# EAGLE design omnetics-adapter-64 (EAGLE 8.3.2)
DESIGNER: JON NEWMAN; DESIGN_NAME: OMNETICS-ADAPTER-64; LICENSE: CERN OHL v1.2; REVISION: 1.1
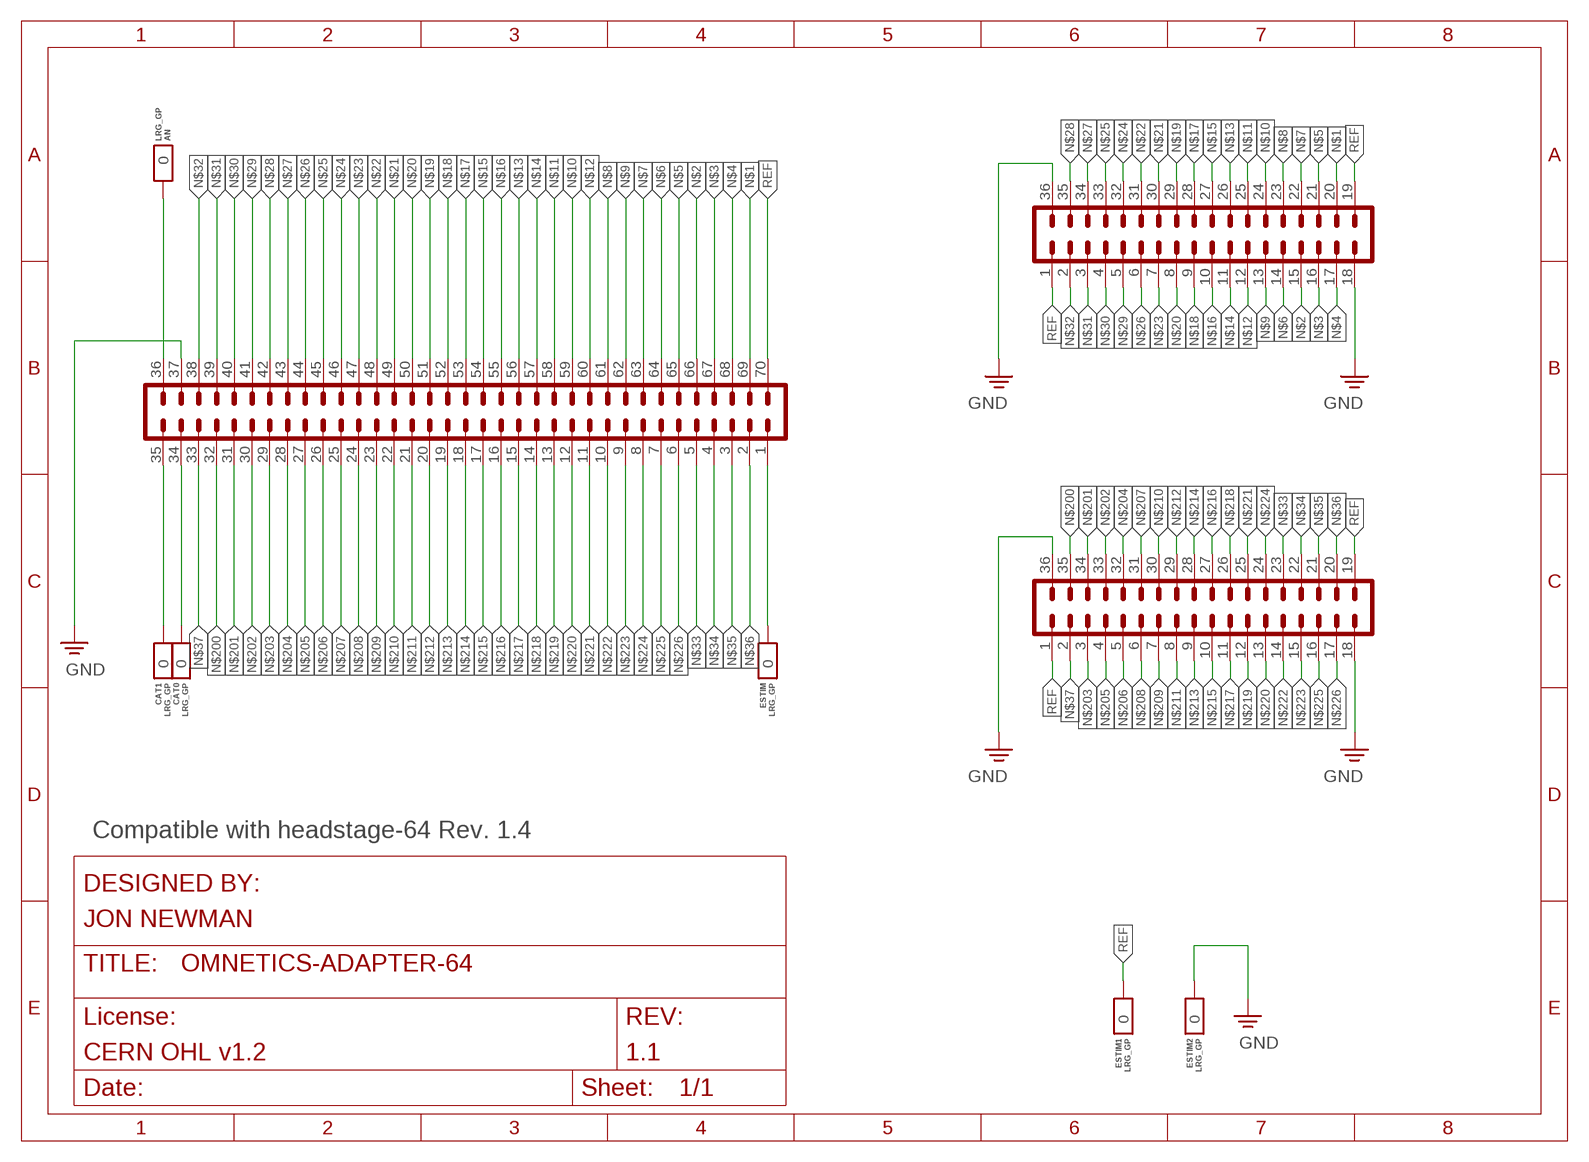
[diagram p0: schematic, sheet 1]

## Parts
AN  LRG_GP  GOLDPIN_0.5ID_0.7OD  [GOLDPIN_0.5ID_0.7OD]
CAT0  LRG_GP  GOLDPIN_0.5ID_0.7OD  [GOLDPIN_0.5ID_0.7OD]
CAT1  LRG_GP  GOLDPIN_0.5ID_0.7OD  [GOLDPIN_0.5ID_0.7OD]
ESTIM  LRG_GP  GOLDPIN_0.5ID_0.7OD  [GOLDPIN_0.5ID_0.7OD]
ESTIM1  LRG_GP  GOLDPIN_0.5ID_0.7OD  [GOLDPIN_0.5ID_0.7OD]
ESTIM2  LRG_GP  GOLDPIN_0.5ID_0.7OD  [GOLDPIN_0.5ID_0.7OD]
J1  DF40-REC  PINHD-2X35_DF40REF-LRG  [DDF40-70REC-LRG]
J2  PINHD-2X18_NPD  [NPD-36-VV-GS]
J3  PINHD-2X18_NPD  [NPD-36-VV-GS]

## Nets
AN: AN.P$1 J1.36
CAT0: CAT0.P$1 J1.34
CAT1: CAT1.P$1 J1.35
ESTIM: ESTIM.P$1 J1.1
GND: ESTIM2.P$1 J1.37 J2.18 J2.36 J3.18 J3.36
N$1: J1.69 J2.20
N$2: J1.66 J2.15
N$3: J1.67 J2.16
N$4: J1.68 J2.17
N$5: J1.65 J2.21
N$6: J1.64 J2.14
N$7: J1.63 J2.22
N$8: J1.61 J2.23
N$9: J1.62 J2.13
N$10: J1.59 J2.24
N$11: J1.58 J2.25
N$12: J1.60 J2.12
N$13: J1.56 J2.26
N$14: J1.57 J2.11
N$15: J1.54 J2.27
N$16: J1.55 J2.10
N$17: J1.53 J2.28
N$18: J1.52 J2.9
N$19: J1.51 J2.29
N$20: J1.50 J2.8
N$21: J1.49 J2.30
N$22: J1.48 J2.31
N$23: J1.47 J2.7
N$24: J1.46 J2.32
N$25: J1.45 J2.33
N$26: J1.44 J2.6
N$27: J1.43 J2.34
N$28: J1.42 J2.35
N$29: J1.41 J2.5
N$30: J1.40 J2.4
N$31: J1.39 J2.3
N$32: J1.38 J2.2
N$33: J1.5 J3.23
N$34: J1.4 J3.22
N$35: J1.3 J3.21
N$36: J1.2 J3.20
N$37: J1.33 J3.2
N$200: J1.32 J3.35
N$201: J1.31 J3.34
N$202: J1.30 J3.33
N$203: J1.29 J3.3
N$204: J1.28 J3.32
N$205: J1.27 J3.4
N$206: J1.26 J3.5
N$207: J1.25 J3.31
N$208: J1.24 J3.6
N$209: J1.23 J3.7
N$210: J1.22 J3.30
N$211: J1.21 J3.8
N$212: J1.20 J3.29
N$213: J1.19 J3.9
N$214: J1.18 J3.28
N$215: J1.17 J3.10
N$216: J1.16 J3.27
N$217: J1.15 J3.11
N$218: J1.14 J3.26
N$219: J1.13 J3.12
N$220: J1.12 J3.13
N$221: J1.11 J3.25
N$222: J1.10 J3.14
N$223: J1.9 J3.15
N$224: J1.8 J3.24
N$225: J1.7 J3.16
N$226: J1.6 J3.17
REF: ESTIM1.P$1 J1.70 J2.1 J2.19 J3.1 J3.19

## Notes on the sheet
- Compatible with headstage-64 Rev. 1.4

## Library data of the parts
AN CAT0 CAT1 ESTIM ESTIM1 ESTIM2 = jonnew:GOLDPIN
J1 = jonnew:PINHD-2X35
J2 J3 = jonnew:PINHD-2X18: Omnetics 36-pin connector, vertical surface-mount

## Board
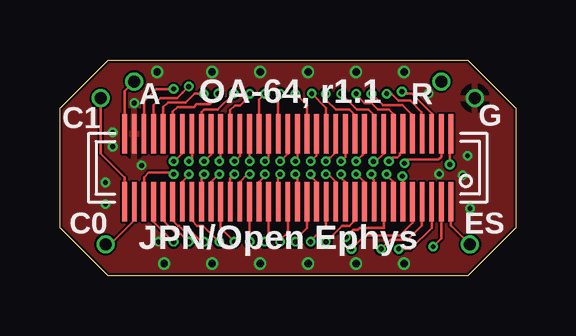
[diagram p1: board, top side]
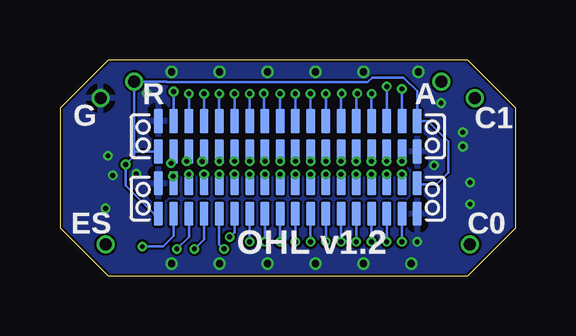
[diagram p2: board, bottom side, seen from below]

Size 19 x 9 mm. Coordinates in mm from the lower left corner, seen from the top.
Outline: 2,9 17,9 19,7 19,2 17,0 2,0 0,2 0,7 2,9
Copper layers (1*16): Top 0.035mm / dielectric 0.2mm / Bottom 0.035mm
Design rules "jlcpcb-2-layer": minimum track width 3.5mil, minimum drill 0.2mm, track to track 3.5mil, track to pad 5mil, pad to pad 5mil, via to via 5mil, smd to smd 0mil, copper to edge 0.1mm, drill to drill 5mil, minimum pad ring 4mil, minimum via ring 4mil, stop-mask expansion 3mil, vias tented up to drill 100mil, thermal gap 10mil

### Footprints (pad centres in the part's own frame; a part is rotated, then mirrored left to right if it is on the bottom)
GOLDPIN_0.5ID_0.7OD = drill 0.5 pad 0.7: P$1 0,0
DDF40-70REC-LRG = smd 0.2 x 1.64: 1 -6.8,1.42; 2 -6.4,1.42; 3 -6,1.42; 4 -5.6,1.42; 5 -5.2,1.42; 6 -4.8,1.42; 7 -4.4,1.42; 8 -4,1.42; 9 -3.6,1.42; 10 -3.2,1.42; 11 -2.8,1.42; 12 -2.4,1.42; 13 -2,1.42; 14 -1.6,1.42; 15 -1.2,1.42; 16 -0.8,1.42; 17 -0.4,1.42; 18 0,1.42; 19 0.4,1.42; 20 0.8,1.42; 21 1.2,1.42; 22 1.6,1.42; 23 2,1.42; 24 2.4,1.42; 25 2.8,1.42; 26 3.2,1.42; 27 3.6,1.42; 28 4,1.42; 29 4.4,1.42; 30 4.8,1.42; 31 5.2,1.42; 32 5.6,1.42; 33 6,1.42; 34 6.4,1.42; 35 6.8,1.42; 36 6.8,-1.42; 37 6.4,-1.42; 38 6,-1.42; 39 5.6,-1.42; 40 5.2,-1.42; 41 4.8,-1.42; 42 4.4,-1.42; 43 4,-1.42; 44 3.6,-1.42; 45 3.2,-1.42; 46 2.8,-1.42; 47 2.4,-1.42; 48 2,-1.42; 49 1.6,-1.42; 50 1.2,-1.42; 51 0.8,-1.42; 52 0.4,-1.42; 53 0,-1.42; 54 -0.4,-1.42; 55 -0.8,-1.42; 56 -1.2,-1.42; 57 -1.6,-1.42; 58 -2,-1.42; 59 -2.4,-1.42; 60 -2.8,-1.42; 61 -3.2,-1.42; 62 -3.6,-1.42; 63 -4,-1.42; 64 -4.4,-1.42; 65 -4.8,-1.42; 66 -5.2,-1.42; 67 -5.6,-1.42; 68 -6,-1.42; 69 -6.4,-1.42; 70 -6.8,-1.42
NPD-36-VV-GS = smd 0.381 x 1.016: 1 0,0; 2 0.635,0; 3 1.27,0; 4 1.905,0; 5 2.54,0; 6 3.175,0; 7 3.81,0; 8 4.445,0; 9 5.08,0; 10 5.715,0; 11 6.35,0; 12 6.985,0; 13 7.62,0; 14 8.255,0; 15 8.89,0; 16 9.525,0; 17 10.16,0; 18 10.795,0; 19 10.795,1.27; 20 10.16,1.27; 21 9.525,1.27; 22 8.89,1.27; 23 8.255,1.27; 24 7.62,1.27; 25 6.985,1.27; 26 6.35,1.27; 27 5.715,1.27; 28 5.08,1.27; 29 4.445,1.27; 30 3.81,1.27; 31 3.175,1.27; 32 2.54,1.27; 33 1.905,1.27; 34 1.27,1.27; 35 0.635,1.27; 36 0,1.27

### Placement (x,y rotation side)
AN  3.1,8.1 0 top
CAT0  1.9,1.3 0 top
CAT1  1.7,7.4 0 top
ESTIM  17.1,1.3 0 top
ESTIM1  15.9,8.1 0 top
ESTIM2  17.3,7.4 0 top
J1  9.5,4.5 180 top
J2  4.1,6.45 180 bottom
J3  4.1,3.85 180 bottom

### Tracks (layer width: path | path; a pad name or v marks a point on that pad's centre or on a via)
AN
  Top 0.1: J1.36 2.7,7.7 AN.P$1
CAT0
  Top 0.1: J1.34 3.1,2.31 2.09,1.3 CAT0.P$1
CAT1
  Top 0.1: J1.35 2.7,4.1 1.7,5.1 CAT1.P$1
ESTIM
  Top 0.1: J1.1 16.3,2.1 ESTIM.P$1
GND  (via drill 0.2, 0.3)
  other vias: 4.1,1.41 16.8,4.18 1.9,2.98 1.9,3.88 2.2,5.98 17.1,2.8 17,5 15.82,4.24 15.38,7.6 2.2,5.38 3.4,4.6 4.05,8.5 6.35,8.5 8.35,8.5 10.35,8.5 12.35,8.5 14.35,8.5 4.35,0.5 6.35,0.5 8.35,0.5 10.35,0.5 12.35,0.5 14.35,0.5 3.1,7.2
  pour Bottom: -1.05,15.85 19.95,15.85 19.95,-7.15 -1.05,-7.15
  pour Top: -4.05,18.85 22.95,18.85 22.95,-10.15 -4.05,-10.15
N$1  (via drill 0.2)
  Top 0.1: J1.69 15.9,4.95 15.79,4.83 14.52,4.83 v14.37,4.68
  Bottom 0.1: J2.20 14.37,5.07 v14.37,4.68
N$2  (via drill 0.2)
  Top 0.1: 12.99,7.61 v12.99,7.59 13.47,7.11 14.28,7.11 14.7,6.69 J1.66
  Bottom 0.1: J2.15 v12.99,7.59
N$3  (via drill 0.2)
  Top 0.1: 13.63,7.57 v13.63,7.59 13.82,7.59 14.11,7.3 14.61,7.3 15.08,6.83 15.08,5.94 J1.67
  Bottom 0.1: J2.16 v13.62,7.59 v13.63,7.59
N$4  (via drill 0.2)
  Top 0.1: 14.26,7.64 v14.26,7.68 14.34,7.6 14.67,7.6 15.5,6.77 J1.68
  Bottom 0.1: v14.26,7.68 J2.17
N$5  (via drill 0.2)
  Top 0.1: v13.72,4.77 13.87,4.92 14.07,4.92 14.18,5.03 14.18,5.09 14.3,5.21 J1.65
  Bottom 0.1: J2.21 13.62,4.77 13.63,4.77 v13.72,4.77
N$6  (via drill 0.2)
  Top 0.1: v12.36,7.59 12.36,7.54 12.7,7.2 12.99,7.2 13.27,6.92 13.71,6.92 13.9,6.73 J1.64
  Bottom 0.1: J2.14 v12.36,7.59
N$7  (via drill 0.2)
  Top 0.1: J1.63 13.5,5.09 13.16,4.76 v13.07,4.76
  Bottom 0.1: J2.22 12.99,4.74 13.01,4.76 v13.07,4.76
N$8  (via drill 0.2)
  Top 0.1: 12.62,5.03 v12.36,4.77 | 12.62,5.03 12.7,5.11 | J1.61 12.7,5.11 | 12.7,5.11 12.62,5.03
  Bottom 0.1: v12.36,4.77 J2.23
N$9  (via drill 0.2)
  Top 0.1: 11.72,7.48 v11.72,7.59 12.4,6.92 12.87,6.92 13.1,6.69 J1.62
  Bottom 0.1: J2.13 v11.72,7.59
N$10  (via drill 0.2)
  Top 0.1: v11.72,4.77 11.9,4.95 J1.59
  Bottom 0.1: J2.24 v11.72,4.77
N$11  (via drill 0.2)
  Top 0.1: 11.24,4.92 11.27,4.92 | 11.11,4.79 v11.09,4.77 | 11.11,4.79 11.24,4.92 | 11.5,5.15 11.27,4.92 | 11.27,4.92 11.24,4.92 | 11.24,4.92 11.11,4.79 | J1.58 11.5,5.15 | 11.5,5.15 11.27,4.92
  Bottom 0.1: J2.25 v11.09,4.77
N$12  (via drill 0.2)
  Top 0.1: J1.60 12.3,6.69 12.07,6.92 11.5,6.92 11.09,7.33 v11.09,7.59
  Bottom 0.1: J2.12 v11.09,7.59
N$13  (via drill 0.2)
  Top 0.1: J1.56 10.7,5.01 v10.45,4.77
  Bottom 0.1: J2.26 v10.45,4.77
N$14  (via drill 0.2)
  Top 0.1: J1.57 11.1,7 v10.5,7.6
  Bottom 0.1: v10.5,7.6 10.5,6.5 J2.11
N$15  (via drill 0.2)
  Top 0.1: J1.54 9.9,4.85 v9.82,4.77
  Bottom 0.1: J2.27 v9.81,4.77 v9.82,4.77
N$16  (via drill 0.2)
  Top 0.1: 10.3,5.15 J1.55 10.3,7.11 v9.82,7.59
  Bottom 0.1: J2.10 v9.81,7.59 v9.82,7.59
N$17  (via drill 0.2)
  Top 0.1: J1.53 9.5,5.08 v9.18,4.77
  Bottom 0.1: J2.28 v9.18,4.77
N$18  (via drill 0.2)
  Top 0.1: J1.52 9.1,7.5 v9.19,7.59
  Bottom 0.1: J2.9 v9.18,7.58 v9.19,7.59
N$19  (via drill 0.2)
  Top 0.1: J1.51 8.7,4.92 v8.55,4.77
  Bottom 0.1: J2.29 v8.54,4.77 v8.55,4.77
N$20  (via drill 0.2)
  Top 0.1: 8.53,7.57 8.3,7.34 | 8.53,7.57 v8.55,7.59 | J1.50 8.3,7.34 | 8.3,7.34 8.53,7.57
  Bottom 0.1: J2.8 v8.54,7.58 v8.55,7.59
N$21  (via drill 0.2)
  Top 0.1: J1.49 v7.9,4.78 v7.91,4.77
  Bottom 0.1: J2.30 v7.91,4.77
N$22  (via drill 0.2)
  Top 0.1: J1.48 7.5,4.99 v7.28,4.77
  Bottom 0.1: J2.31 v7.28,4.77
N$23  (via drill 0.2)
  Top 0.1: v7.92,7.59 7.92,7.52 7.5,7.1 7.3,7.1 7.1,6.9 J1.47
  Bottom 0.1: J2.7 v7.91,7.58 v7.92,7.59
N$24  (via drill 0.2)
  Top 0.1: J1.46 6.7,4.83 v6.64,4.77
  Bottom 0.1: J2.32 v6.64,4.77
N$25  (via drill 0.2)
  Top 0.1: J1.45 6.3,5.06 v6.01,4.77
  Bottom 0.1: J2.33 v6,4.77 v6.01,4.77
N$26  (via drill 0.2)
  Top 0.1: v7.25,7.6 6.57,6.92 6,6.92 5.9,6.82 J1.44
  Bottom 0.1: J2.6 7.28,7.58 v7.25,7.6
N$27  (via drill 0.2)
  Top 0.1: J1.43 5.5,4.89 v5.37,4.77
  Bottom 0.1: J2.34 v5.37,4.77
N$28  (via drill 0.2)
  Top 0.1: v4.74,4.77 4.77,4.77 5.1,5.1 J1.42
  Bottom 0.1: J2.35 v4.74,4.77
N$29  (via drill 0.2)
  Top 0.1: v6.6,7.6 6.6,7.5 6.25,7.15 5.7,7.15 5.58,7.03 4.9,7.03 4.7,6.83 J1.41
  Bottom 0.1: J2.5 6.64,7.56 v6.6,7.6
N$30  (via drill 0.2)
  Top 0.1: v6,7.59 v6,7.6 5.62,7.6 5.24,7.22 4.5,7.22 4.3,7.02 J1.40
  Bottom 0.1: J2.4 v6,7.58 v6,7.59
N$31  (via drill 0.2)
  Top 0.1: v5.37,7.89 5.12,7.64 5.12,7.63 4.89,7.41 4.2,7.41 3.9,7.11 J1.39
  Bottom 0.1: J2.3 v5.37,7.89
N$32  (via drill 0.2)
  Top 0.1: v4.74,7.79 4,7.79 3.5,7.29 J1.38
  Bottom 0.1: v4.74,7.79 J2.2
N$33  (via drill 0.2)
  Top 0.1: J1.5 14.7,2.2 14.18,1.68 13.69,1.68 12.7,1.68 12.7,1.65 v12.16,1.11
  Bottom 0.1: J3.23 12.36,1.31 v12.16,1.11
N$34  (via drill 0.2)
  Top 0.1: J1.4 15.1,2.1 14.49,1.49 13.77,1.49 v13.39,1.11
  Bottom 0.1: J3.22 12.99,1.51 v13.39,1.11
N$35  (via drill 0.2)
  Top 0.1: J1.3 15.5,2 14.61,1.11 v14.13,1.11
  Bottom 0.1: 13.62,2.08 J3.21 13.62,1.61 v14.13,1.11
N$36  (via drill 0.2)
  Top 0.1: J1.2 15.9,1.55 v15.56,1.21
  Bottom 0.1: v15.56,1.21 14.7,1.21 14.26,1.65 J3.20
N$37  (via drill 0.2)
  Top 0.1: J1.33 3.5,4.1 3.7,4.3 4.7,4.3
  Top 0.152: v4.74,4.23 4.74,4.26 4.7,4.3
  Bottom 0.1: J3.2 v4.74,4.23
N$200  (via drill 0.2)
  Top 0.1: J1.32 3.9,2.25 v4.74,1.41
  Bottom 0.1: v4.74,1.41 J3.35
N$201  (via drill 0.2)
  Top 0.1: J1.31 4.3,2.31 4.82,1.79 4.89,1.79 4.94,1.74 5.04,1.74 v5.37,1.41
  Bottom 0.1: J3.34 v5.37,1.41
N$202  (via drill 0.2)
  Top 0.1: 4.7,2.72 J1.30 4.7,2.31 4.93,2.08 4.97,2.08 5.26,1.79 5.53,1.79 5.91,1.41 v6.01,1.41
  Bottom 0.1: J3.33 v6,1.41 v6.01,1.41
N$203  (via drill 0.2)
  Top 0.1: J1.29 5.1,3.9 5.37,4.17 v5.37,4.23
  Bottom 0.1: J3.3 v5.37,4.23
N$204  (via drill 0.2)
  Top 0.1: J1.28 5.5,2.31 5.73,2.08 5.97,2.08 v6.64,1.41
  Bottom 0.1: J3.32 v6.64,1.41
N$205  (via drill 0.2)
  Top 0.1: v6.01,4.23 5.9,4.12 J1.27
  Bottom 0.1: J3.4 v6,4.23 v6.01,4.23
N$206  (via drill 0.2)
  Top 0.1: J1.26 6.3,3.9 v6.63,4.23 v6.64,4.23
  Bottom 0.1: J3.5 v6.64,4.23
N$207  (via drill 0.2)
  Top 0.1: v7.28,1.41 6.7,1.99 J1.25
  Bottom 0.1: v7.28,1.41 7.25,1.44 7.28,1.46 J3.31
N$208  (via drill 0.2)
  Top 0.1: v7.28,4.23 7.1,4.05 J1.24
  Bottom 0.1: J3.6 v7.28,4.23
N$209  (via drill 0.2)
  Top 0.1: J1.23 7.5,3.9 7.83,4.23 v7.91,4.23
  Bottom 0.1: J3.7 v7.91,4.23
N$210  (via drill 0.2)
  Top 0.1: v7.91,1.41 7.9,1.42 J1.22
  Bottom 0.1: J3.30 7.91,1.7 | 7.91,1.7 7.9,1.69 | 7.91,1.7 v7.91,1.41
N$211  (via drill 0.2)
  Top 0.1: J1.21 8.3,3.9 8.55,4.15 v8.55,4.23
  Bottom 0.1: J3.8 v8.54,4.23 v8.55,4.23
N$212  (via drill 0.2)
  Top 0.1: v8.55,1.41 8.7,1.56 J1.20
  Bottom 0.1: J3.29 v8.54,1.41 v8.55,1.41
N$213  (via drill 0.2)
  Top 0.1: v9.18,4.23 9.1,4.15 J1.19
  Bottom 0.1: J3.9 v9.18,4.23
N$214  (via drill 0.2)
  Top 0.1: J1.18 9.5,1.8 9.18,1.48 v9.18,1.41
  Bottom 0.1: J3.28 v9.18,1.41
N$215  (via drill 0.2)
  Top 0.1: v9.82,4.23 9.9,4.15 J1.17
  Bottom 0.1: J3.10 v9.81,4.23 v9.82,4.23
N$216  (via drill 0.2)
  Top 0.1: v9.82,1.41 9.82,1.5 10.3,1.98 J1.16
  Bottom 0.1: J3.27 9.81,1.7 9.82,1.7 v9.82,1.41
N$217  (via drill 0.2)
  Top 0.1: J1.15 10.7,3.9 10.45,4.15 v10.45,4.23
  Bottom 0.1: J3.11 v10.45,4.23
N$218  (via drill 0.2)
  Top 0.1: v10.45,1.41 10.45,1.45 11.1,2.1 J1.14
  Bottom 0.1: J3.26 v10.45,1.41
N$219  (via drill 0.2)
  Top 0.1: J1.13 11.5,3.9 11.17,4.23 v11.09,4.23
  Bottom 0.1: J3.12 v11.09,4.23
N$220  (via drill 0.2)
  Top 0.1: J1.12 11.9,3.9 11.72,4.08 v11.72,4.23
  Bottom 0.1: J3.13 v11.72,4.23
N$221  (via drill 0.2)
  Top 0.1: J1.11 12.3,2.31 12.07,2.08 11.76,2.08 v11.09,1.41
  Bottom 0.1: J3.25 v11.09,1.41
N$222  (via drill 0.2)
  Top 0.1: J1.10 12.7,3.9 v12.37,4.23 v12.36,4.23
  Bottom 0.1: J3.14 v12.36,4.23
N$223  (via drill 0.2)
  Top 0.1: J1.9 13.1,4 13,4.1 v13,4.22 v12.99,4.23
  Bottom 0.1: J3.15 v12.99,4.23
N$224  (via drill 0.2)
  Top 0.1: J1.8 13.5,2 12.5,2 12.4,1.9 12.21,1.9 v11.92,1.61
  Bottom 0.1: J3.24 11.72,1.81 v11.92,1.61
N$225  (via drill 0.2)
  Top 0.1: J1.7 13.9,3.9 13.63,4.17 v13.63,4.23
  Bottom 0.1: J3.16 v13.62,4.23 v13.63,4.23
N$226  (via drill 0.2)
  Top 0.1: J1.6 14.3,4.04 14.28,4.06 v14.28,4.14
  Bottom 0.1: v14.28,4.14 14.28,3.87 J3.17
REF  (via drill 0.2)
  Top 0.1: J1.70 16.26,5.88 v16.26,4.64
  Bottom 0.1: J3.19 15.08,2.58 16.26,3.76 v16.26,4.64 15.9,5 15.9,5.1 15.9,5.15 | 14.91,5.2 J2.19 15.87,5.18 15.9,5.15 | J3.1 4.05,3.8 3.3,3.8 2.8,4.3 2.8,5.6 3.65,6.45 J2.1 4.1,7.69 4.68,8.27 5.97,8.27 6.17,8.07 14.53,8.07 14.56,8.1 ESTIM1.P$1 15.9,5.15

### Text on the board
tPlace: A | OA-64, r1.1 | R | C1 | G | C0 | ES | JPN/Open Ephys
bPlace: A | R | C1 | G | C0 | ES | OHL v1.2